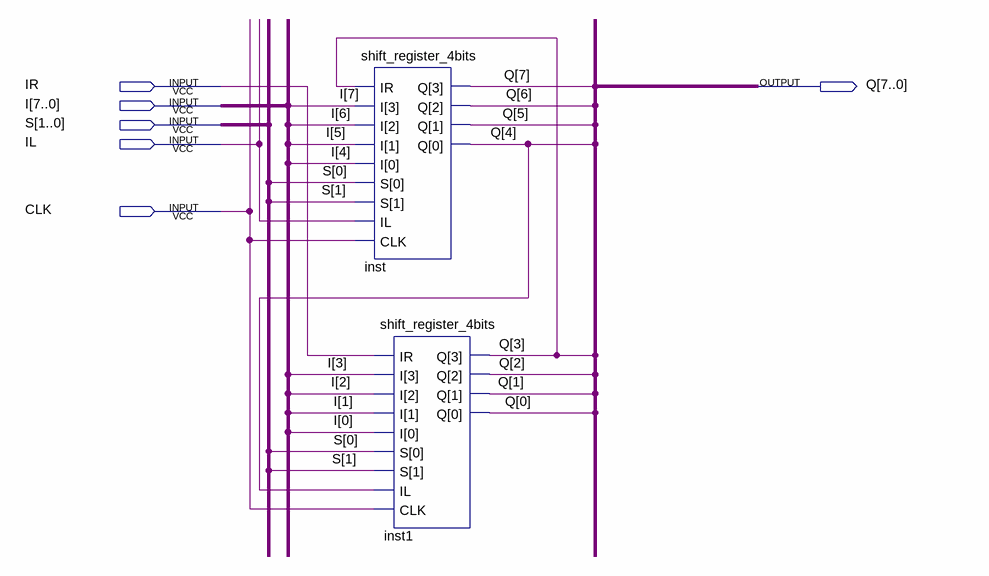
[diagram p0: schematic sheet]
// Quartus schematic shift_register_8bits.bdf as structural Verilog: 2 symbols, 6 pins
module shift_register_8bits (
  input  IR,
  input  [7:0] I,
  input  [1:0] S,
  input  IL,
  input  CLK,
  output [7:0] Q
);

  shift_register_4bits inst (.IR(Q[3]), .I(I[7:4]), .S(S), .IL(IL), .CLK(CLK), .Q(Q[7:4]));
  shift_register_4bits inst1 (.IR(IR), .I(I[3:0]), .S(S), .IL(Q[4]), .CLK(CLK), .Q(Q[3:0]));
endmodule
